# Altium schematic sheet MAIN.SchDoc
size A4
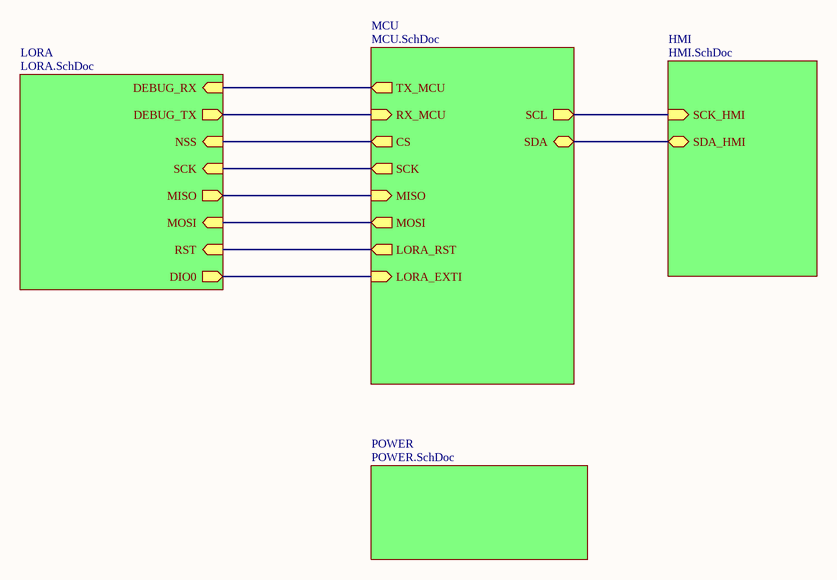
[diagram p0: MAIN.SchDoc]

## Sub-sheets
HMI = HMI.SchDoc: SCK_HMI (in), SDA_HMI (bidir)
LORA = LORA.SchDoc: DIO0 (out), DEBUG_RX (in), DEBUG_TX (out), SCK (in), NSS (in), RST (in), MISO (out), MOSI (in)
MCU = MCU.SchDoc: TX_MCU (out), RX_MCU (in), CS (out), SCK (out), MISO (in), MOSI (out), LORA_RST (out), LORA_EXTI (in), SCL (out), SDA (bidir)
POWER = POWER.SchDoc: no entries

## Nets
(unnamed): sheet MCU/TX_MCU, sheet LORA/DEBUG_RX
(unnamed): sheet MCU/RX_MCU, sheet LORA/DEBUG_TX
(unnamed): sheet MCU/CS, sheet LORA/NSS
(unnamed): sheet MCU/SCK, sheet LORA/SCK
(unnamed): sheet MCU/MISO, sheet LORA/MISO
(unnamed): sheet MCU/MOSI, sheet LORA/MOSI
(unnamed): sheet MCU/LORA_RST, sheet LORA/RST
(unnamed): sheet MCU/LORA_EXTI, sheet LORA/DIO0
(unnamed): sheet MCU/SCL, sheet HMI/SCK_HMI
(unnamed): sheet MCU/SDA, sheet HMI/SDA_HMI